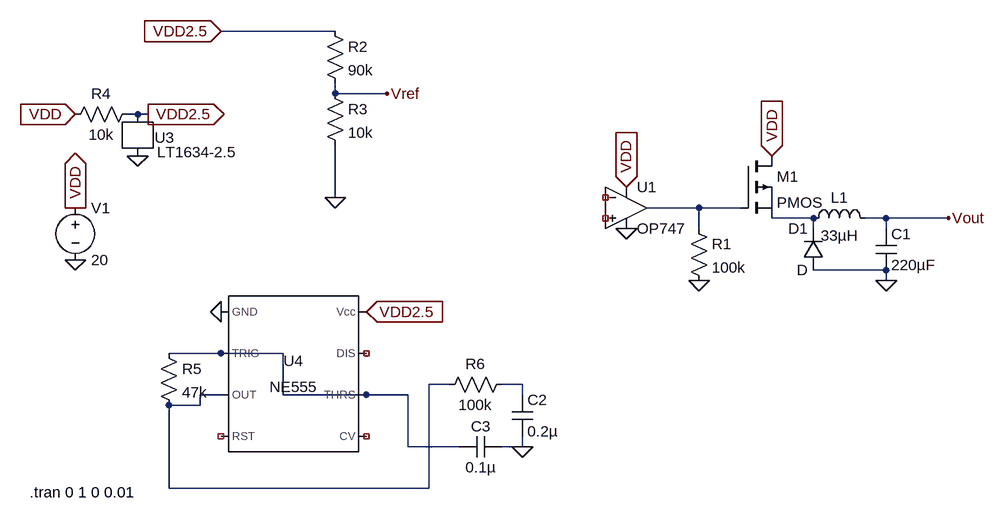
[diagram p0: schematic Draft4.asc]
Draft4.asc, the LTspice schematic file:
Version 4
SHEET 1 904 680
WIRE -112 -144 -288 -144
WIRE -112 -48 -112 -64
WIRE -32 -48 -112 -48
WIRE -416 -16 -432 -16
WIRE -400 -16 -416 -16
WIRE -112 112 -112 32
WIRE 448 128 368 128
WIRE 512 128 448 128
WIRE 624 144 560 144
WIRE 736 144 704 144
WIRE 832 144 736 144
WIRE 448 160 448 128
WIRE 624 160 624 144
WIRE 736 160 736 144
WIRE 736 224 624 224
WIRE 736 240 736 224
WIRE -288 352 -368 352
WIRE -192 352 -288 352
WIRE 64 400 32 400
WIRE 176 400 144 400
WIRE -288 416 -320 416
WIRE -192 416 -192 352
WIRE -64 416 -192 416
WIRE 0 416 -64 416
WIRE 176 416 176 400
WIRE -320 432 -320 416
WIRE -320 432 -368 432
WIRE 0 496 0 416
WIRE 80 496 0 496
WIRE 176 496 176 480
WIRE 176 496 144 496
WIRE -368 560 -368 432
WIRE 32 560 32 400
WIRE 32 560 -368 560
FLAG -416 48 0
FLAG -112 112 0
FLAG 448 240 0
FLAG -512 208 0
FLAG -512 -16 VDD
IOPIN -512 -16 In
FLAG -512 128 VDD
IOPIN -512 128 Out
FLAG -32 -48 Vref
FLAG 336 160 0
FLAG 736 240 0
FLAG 832 144 Vout
FLAG -288 288 0
FLAG 176 496 0
FLAG -288 -144 VDD2.5
IOPIN -288 -144 In
FLAG -400 -16 VDD2.5
IOPIN -400 -16 Out
FLAG 336 96 VDD
IOPIN 336 96 In
FLAG 560 48 VDD
IOPIN 560 48 In
FLAG -64 288 VDD2.5
IOPIN -64 288 In
SYMBOL pmos 512 48 R0
SYMATTR InstName M1
SYMBOL OpAmps\\OP747 336 64 R0
SYMATTR InstName U1
SYMBOL res 432 144 R0
SYMATTR InstName R1
SYMATTR Value 100k
SYMBOL res -128 -160 R0
SYMATTR InstName R2
SYMATTR Value 90k
SYMBOL res -128 -64 R0
SYMATTR InstName R3
SYMATTR Value 10k
SYMBOL res -416 -32 R90
WINDOW 0 0 56 VBottom 2
WINDOW 3 32 56 VTop 2
SYMATTR InstName R4
SYMATTR Value 10k
SYMBOL References\\LT1634-2.5 -416 16 R0
WINDOW 0 26 4 Left 2
SYMATTR InstName U3
SYMBOL voltage -512 112 R0
WINDOW 123 0 0 Left 0
WINDOW 39 0 0 Left 0
SYMATTR InstName V1
SYMATTR Value 20
SYMBOL Misc\\NE555 -176 384 R0
SYMATTR InstName U4
SYMBOL ind 608 160 R270
WINDOW 0 32 56 VTop 2
WINDOW 3 5 56 VBottom 2
SYMATTR InstName L1
SYMATTR Value 33µH
SYMBOL cap 720 160 R0
SYMATTR InstName C1
SYMATTR Value 220µF
SYMBOL diode 640 224 R180
WINDOW 0 24 64 Left 2
WINDOW 3 24 0 Left 2
SYMATTR InstName D1
SYMBOL res -384 336 R0
SYMATTR InstName R5
SYMATTR Value 47k
SYMBOL res 160 384 R90
WINDOW 0 0 56 VBottom 2
WINDOW 3 32 56 VTop 2
SYMATTR InstName R6
SYMATTR Value 100k
SYMBOL cap 160 416 R0
SYMATTR InstName C2
SYMATTR Value 0.2µ
SYMBOL cap 144 480 R90
WINDOW 0 0 32 VBottom 2
WINDOW 3 32 32 VTop 2
SYMATTR InstName C3
SYMATTR Value 0.1µ
TEXT -582 566 Left 2 !.tran 0 1 0 0.01

The netlist it stands for:
* Draft4.asc
M1 VDD N001 N002 N002 PMOS
XU1 NC_01 NC_02 VDD 0 N001 OP747  ; pins In+ In- V+ V- OUT
R1 N001 0 100k
R2 VDD2.5 Vref 90k
R3 Vref 0 10k
R4 VDD2.5 VDD 10k
XU3 VDD2.5 0 LT1634-2.5
V1 VDD 0 20
XU4 0 N003 N004 NC_03 NC_04 N003 NC_05 VDD2.5 NE555  ; pins GND TRIG OUT RST CV THRS DIS Vcc
L1 N002 Vout 33µH
C1 Vout 0 220µF
D1 0 N002 D
R5 N003 N004 47k
R6 N005 N004 100k
C2 N005 0 0.2µ
C3 0 N003 0.1µ
.model D D
.lib standard.dio
.model NMOS NMOS
.model PMOS PMOS
.lib standard.mos
.tran 0 1 0 0.01
.lib NE555.sub
.backanno
.end